# Altium schematic sheet mainckt.SchDoc
size A
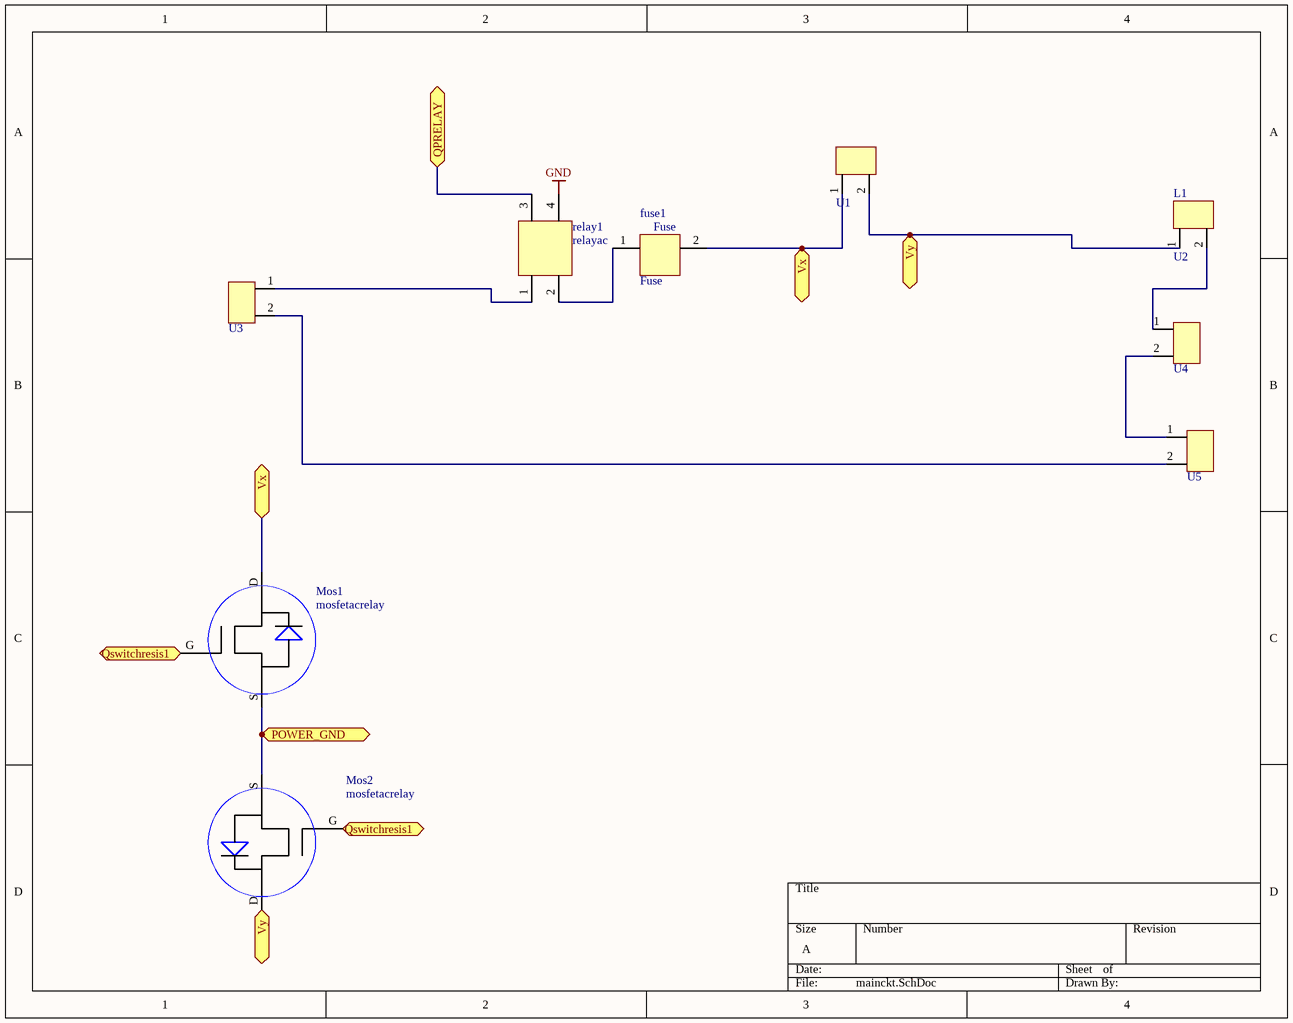
[diagram p0: mainckt.SchDoc]

## Parts
fuse1  Fuse  [fuse10a]
Mos1  mosfetacrelay  [mosfet600v30A]
Mos2  mosfetacrelay  [mosfet600v30A]
relay1  relayac  [acrelay]
U1  Connector 60A  [newconn60A]  (value not drawn)
U2  L1  [newconn60A]
U3  Connector 60A  [newconn60A]  (value not drawn)
U4  Connector 60A  [newconn60A]  (value not drawn)
U5  Connector 60A  [newconn60A]  (value not drawn)

## Ports
POWER_GND (bidir), QPRELAY (bidir), Qswitchresis1 (bidir), Vx (bidir), Vy (bidir)

## Nets
GND: relay1.4
POWER_GND: Mos1.S Mos2.S ; port POWER_GND
QPRELAY: relay1.3 ; port QPRELAY
Qswitchresis1: Mos1.G Mos2.G ; port Qswitchresis1
Vx: fuse1.2 Mos1.D U1.1 ; port Vx
Vy: Mos2.D U1.2 U2.1 ; port Vy
Netfuse1_1: fuse1.1 relay1.2
Netrelay1_1: relay1.1 U3.1
NetU2_2: U2.2 U4.1
NetU3_2: U3.2 U5.2
NetU4_2: U4.2 U5.1

## Library data of the parts
U2 = Connector 60A